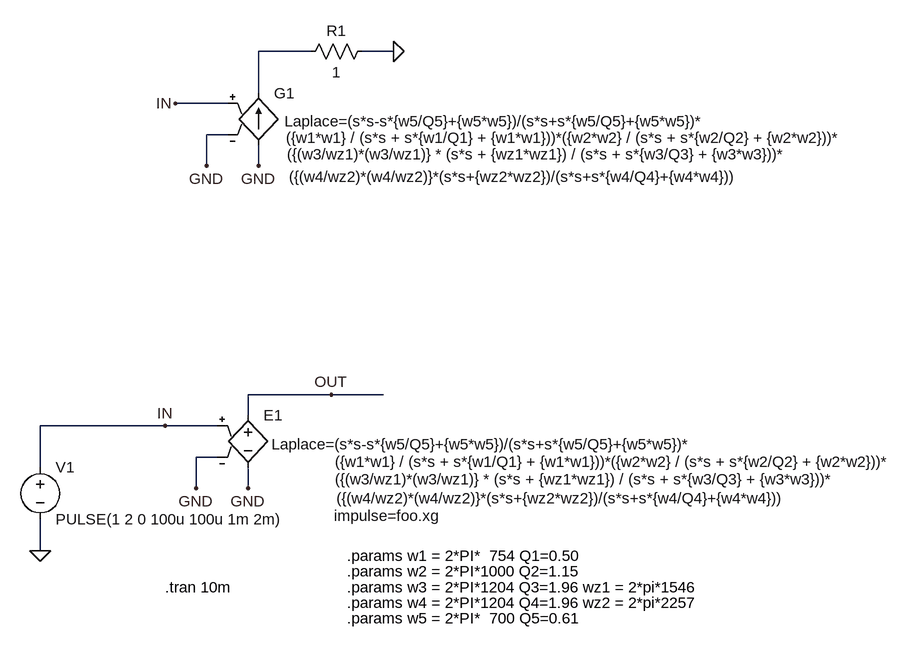
[diagram p0: schematic dcinitissue.asc]
dcinitissue.asc, the LTspice schematic file:
Version 4
SHEET 1 1800 688
WIRE 656 -368 656 -336
WIRE 608 -384 576 -384
WIRE 576 -384 576 -336
WIRE 656 -448 656 -480
WIRE 656 -480 784 -480
WIRE 608 -432 528 -432
WIRE 528 -432 336 -432
WIRE 784 -480 864 -480
WIRE 336 -368 336 -432
WIRE 336 -240 336 -288
WIRE 672 -864 672 -832
WIRE 624 -880 592 -880
WIRE 592 -880 592 -832
WIRE 672 -944 672 -1008
WIRE 624 -928 544 -928
WIRE 672 -1008 752 -1008
WIRE 832 -1008 880 -1008
FLAG 656 -336 GND
FLAG 576 -336 GND
FLAG 528 -432 IN
FLAG 784 -480 OUT
FLAG 336 -240 0
FLAG 672 -832 GND
FLAG 592 -832 GND
FLAG 544 -928 IN
FLAG 880 -1008 0
SYMBOL e 656 -464 R0
WINDOW 3 134 87 Left 0
WINDOW 38 36 60 Left 0
WINDOW 39 136 143 Left 0
WINDOW 123 134 114 Left 0
WINDOW 40 132 170 Left 0
SYMATTR Value ({w1*w1} / (s*s + s*{w1/Q1} + {w1*w1}))*({w2*w2} / (s*s + s*{w2/Q2} + {w2*w2}))*
SYMATTR SpiceModel Laplace=(s*s-s*{w5/Q5}+{w5*w5})/(s*s+s*{w5/Q5}+{w5*w5})*
SYMATTR SpiceLine ({(w4/wz2)*(w4/wz2)}*(s*s+{wz2*wz2})/(s*s+s*{w4/Q4}+{w4*w4}))
SYMATTR Value2 ({(w3/wz1)*(w3/wz1)} * (s*s + {wz1*wz1}) / (s*s + s*{w3/Q3} + {w3*w3}))*
SYMATTR SpiceLine2 impulse=foo.xg
SYMATTR InstName E1
SYMBOL voltage 336 -384 R0
SYMATTR InstName V1
SYMATTR Value PULSE(1 2 0 100u 100u 1m 2m)
SYMBOL g 672 -960 R0
WINDOW 3 40 59 Left 0
WINDOW 123 42 85 Left 0
WINDOW 39 44 110 Left 0
WINDOW 40 47 145 Left 0
SYMATTR InstName G1
SYMATTR Value Laplace=(s*s-s*{w5/Q5}+{w5*w5})/(s*s+s*{w5/Q5}+{w5*w5})*
SYMATTR Value2 ({w1*w1} / (s*s + s*{w1/Q1} + {w1*w1}))*({w2*w2} / (s*s + s*{w2/Q2} + {w2*w2}))*
SYMATTR SpiceLine ({(w3/wz1)*(w3/wz1)} * (s*s + {wz1*wz1}) / (s*s + s*{w3/Q3} + {w3*w3}))*
SYMATTR SpiceLine2 ({(w4/wz2)*(w4/wz2)}*(s*s+{wz2*wz2})/(s*s+s*{w4/Q4}+{w4*w4}))
SYMBOL res 848 -1024 R90
WINDOW 0 0 56 VBottom 0
WINDOW 3 32 56 VTop 0
SYMATTR InstName R1
SYMATTR Value 1
TEXT 808 -208 Left 0 !.params w2 = 2*PI*1000 Q2=1.15
TEXT 808 -184 Left 0 !.params w3 = 2*PI*1204 Q3=1.96 wz1 = 2*pi*1546
TEXT 808 -160 Left 0 !.params w4 = 2*PI*1204 Q4=1.96 wz2 = 2*pi*2257
TEXT 808 -136 Left 0 !.params w5 = 2*PI*  700 Q5=0.61
TEXT 528 -184 Left 0 !.tran 10m
TEXT 808 -232 Left 0 !.params w1 = 2*PI*  754 Q1=0.50

The netlist it stands for:
* dcinitissue.asc
E1 OUT GND IN GND Laplace=(s*s-s*{w5/Q5}+{w5*w5})/(s*s+s*{w5/Q5}+{w5*w5})* ({w1*w1} / (s*s + s*{w1/Q1} + {w1*w1}))*({w2*w2} / (s*s + s*{w2/Q2} + {w2*w2}))* ({(w3/wz1)*(w3/wz1)} * (s*s + {wz1*wz1}) / (s*s + s*{w3/Q3} + {w3*w3}))* ({(w4/wz2)*(w4/wz2)}*(s*s+{wz2*wz2})/(s*s+s*{w4/Q4}+{w4*w4})) impulse=foo.xg
V1 IN 0 PULSE(1 2 0 100u 100u 1m 2m)
G1 GND N001 IN GND Laplace=(s*s-s*{w5/Q5}+{w5*w5})/(s*s+s*{w5/Q5}+{w5*w5})* ({w1*w1} / (s*s + s*{w1/Q1} + {w1*w1}))*({w2*w2} / (s*s + s*{w2/Q2} + {w2*w2}))* ({(w3/wz1)*(w3/wz1)} * (s*s + {wz1*wz1}) / (s*s + s*{w3/Q3} + {w3*w3}))* ({(w4/wz2)*(w4/wz2)}*(s*s+{wz2*wz2})/(s*s+s*{w4/Q4}+{w4*w4}))
R1 0 N001 1
.params w2 = 2*PI*1000 Q2=1.15
.params w3 = 2*PI*1204 Q3=1.96 wz1 = 2*pi*1546
.params w4 = 2*PI*1204 Q4=1.96 wz2 = 2*pi*2257
.params w5 = 2*PI*  700 Q5=0.61
.tran 10m
.params w1 = 2*PI*  754 Q1=0.50
.backanno
.end